# Altium schematic sheet TX.SchDoc
size A3; DocumentNumber: No here; SheetNumber: 1; SheetTotal: 1
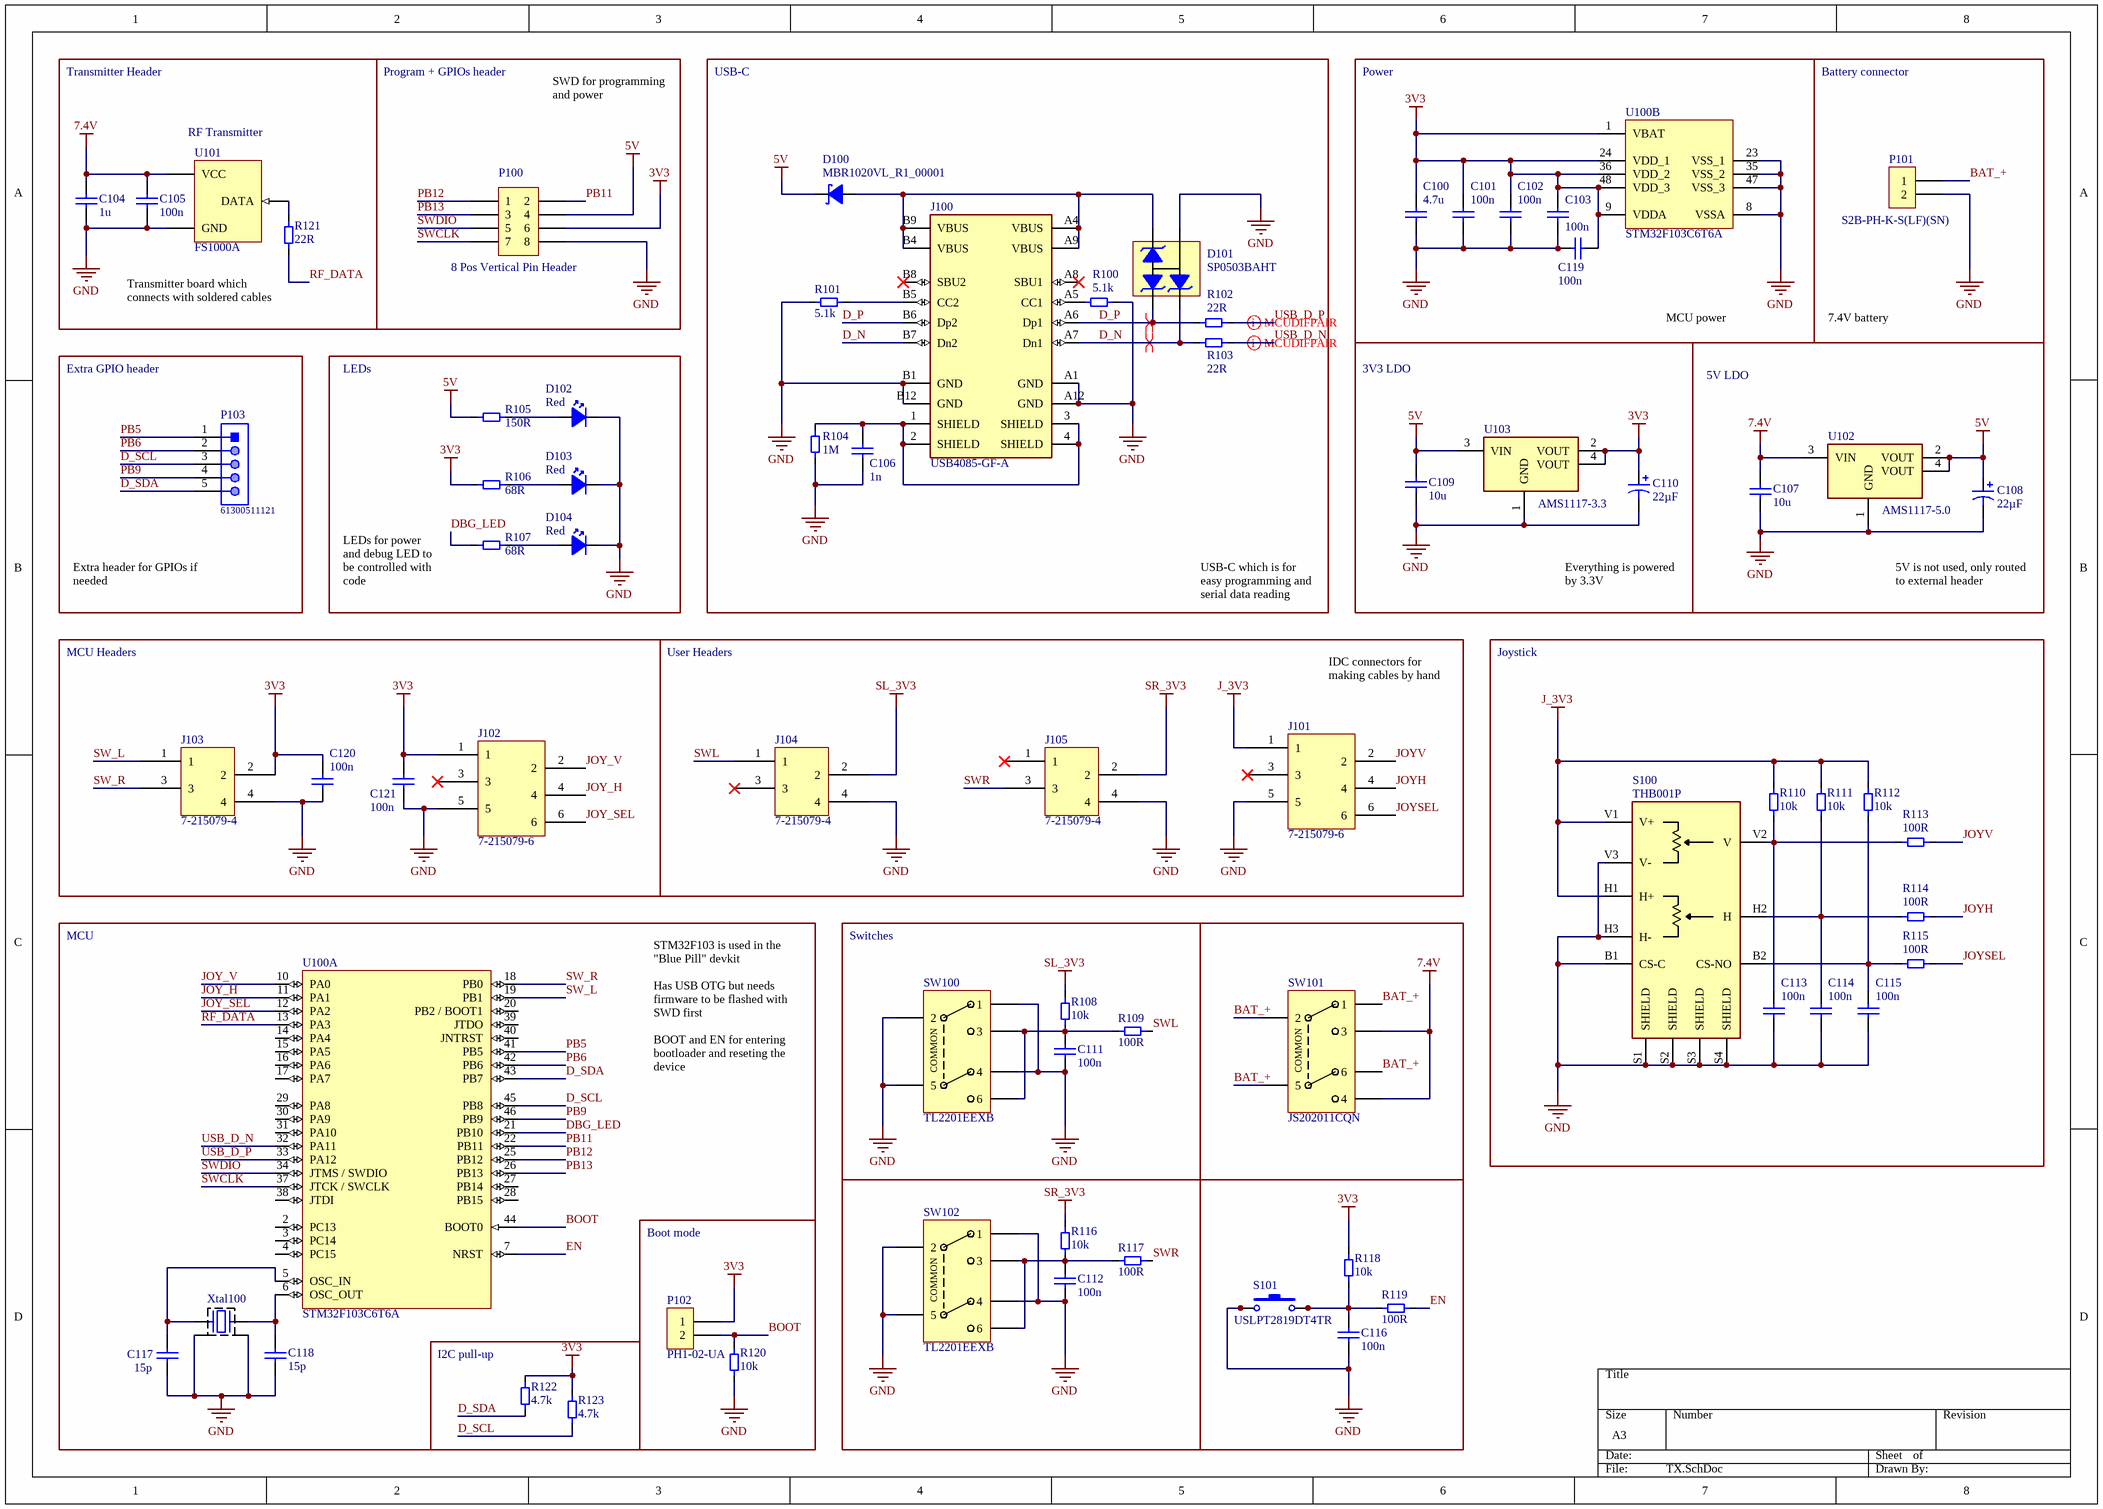
[diagram p0: TX.SchDoc]

## Parts
C100  4.7u  [MLCC_0805_M]
C101  100n  [MLCC_0603_M]
C102  100n  [MLCC_0603_M]
C103  100n  [MLCC_0603_M]
C104  1u  [MLCC_0603_M]
C105  100n  [MLCC_0603_M]
C106  1n  [MLCC_0603_M]
C107  10u  [MLCC_0805_M]
C108  value 22µF  [1210_Tantalum]  (hidden comment: TCJB226M025R0150)
C109  10u  [MLCC_0805_M]
C110  value 22µF  [1210_Tantalum]  (hidden comment: TCJB226M025R0150)
C111  100n  [MLCC_0603_M]
C112  100n  [MLCC_0603_M]
C113  100n  [MLCC_0603_M]
C114  100n  [MLCC_0603_M]
C115  100n  [MLCC_0603_M]
C116  100n  [MLCC_0603_M]
C117  15p  [MLCC_0402_M]
C118  15p  [MLCC_0402_M]
C119  100n  [MLCC_0603_M]
C120  100n  [MLCC_0603_M]
C121  100n  [MLCC_0603_M]
D100  MBR1020VL_R1_00001  [FP-MBR1020VL_R1_00001-MFG]
D101  SP0503BAHT  [LFUS-SOT143-4_V]
D102  Red  [0603 RED LED]
D103  Red  [0603 RED LED]
D104  Red  [0603 RED LED]
J100  USB4085-GF-A  [FP-USB4085-GF-A-MFG]
J101  7-215079-6  [7-215079-6-Footprint-1]
J102  7-215079-6  [7-215079-6-Footprint-1]
J103  7-215079-4  [7-215079-4]
J104  7-215079-4  [7-215079-4]
J105  7-215079-4  [7-215079-4]
P100  8 Pos Vertical Pin Header  [8 POS Vertical Pin Header]
P101  S2B-PH-K-S(LF)(SN)  [B5B-PH-K-S(LF)(SN)]
P102  PH1-02-UA  [2Pos Pin Header Vertical]
P103  61300511121  [61300511121]
R100  5.1k  [Resistor_0603_M]
R101  5.1k  [Resistor_0603_M]
R102  22R  [Resistor_0603_M]
R103  22R  [Resistor_0603_M]
R104  1M  [Resistor_1206_M]
R105  150R  [Resistor_0603_M]
R106  68R  [Resistor_0603_M]
R107  68R  [Resistor_0603_M]
R108  10k  [Resistor_0603_M]
R109  100R  [Resistor_0603_M]
R110  10k  [Resistor_0603_M]
R111  10k  [Resistor_0603_M]
R112  10k  [Resistor_0603_M]
R113  100R  [Resistor_0603_M]
R114  100R  [Resistor_0603_M]
R115  100R  [Resistor_0603_M]
R116  10k  [Resistor_0603_M]
R117  100R  [Resistor_0603_M]
R118  10k  [Resistor_0603_M]
R119  100R  [Resistor_0603_M]
R120  10k  [Resistor_0603_M]
R121  22R  [Resistor_0603_M]
R122  4.7k  [Resistor_0603_M]
R123  4.7k  [Resistor_0603_M]
S100  THB001P  [THB001P]
S101  USLPT2819DT4TR  [USLPT2819DT4TR-Footprint-1]
SW100  TL2201EEXB  [TL2201EEXB-Footprint-1]
SW101  JS202011CQN  [FP-JS202011CQN-MFG]
SW102  TL2201EEXB  [TL2201EEXB-Footprint-1]
U100  STM32F103C6T6A  [STM-LQFP48_M]  (parts A,B of 2)
U101  FS1000A  [2.54mm 3-pin horizontal]
U102  AMS1117-5.0  [SOT230P700X180-4N]
U103  AMS1117-3.3  [SOT-223 based on ZVP2110GTA]
Xtal100  ABM11-16.000MHZ-12-N1G-T  [FP-ABM11-MFG]  (value not drawn)

## Blocks framed on the sheet
Program + GPIOs header: P100
USB-C: C106 D100 D101 J100 R100-R104
Power: C100-C103 C119 U100
Battery connector: P101
3V3 LDO: C109 C110 U103
5V LDO: C107 C108 U102
Extra GPIO header: P103
LEDs: D102-D104 R105-R107
MCU Headers: C120 C121 J102 J103
User Headers: J101 J104 J105
Joystick: C113-C115 R110-R115 S100
MCU: C117 C118 U100 Xtal100
Switches: C111 R108 R109 SW100
Boot mode: P102 R120
I2C pull-up: R122 R123

## Nets
3V3: C100.2 C101.1 C102.1 C103.1 C110.1 C119.2 C120.2 C121.2 J102.1 J103.2 P100.6 P102.1 R106.1 R118.2 R122.2 R123.2 U100.1(VBAT) U100.9(VDDA) U100.24(VDD_1) U100.36(VDD_2) U100.48(VDD_3) U103.2(VOUT) U103.4(VOUT)
5V: C108.1 C109.2 D100.1(C) P100.4 R105.1 U102.2(VOUT) U102.4(VOUT) U103.3(VIN)
7.4V: C104.2 C105.2 C107.2 SW101.3 SW101.4 U101.2(VCC) U102.3(VIN)
GND: C100.1 C101.2 C102.2 C103.2 C104.1 C105.1 C106.1 C107.1 C108.2 C109.1 C110.2 C111.1 C112.1 C113.1 C114.1 C115.1 C116.1 C117.1 C118.1 C119.1 C120.1 C121.1 D101.1(A) D102.1(C) D103.1(C) D104.1(C) J100.A1(GND) J100.A12(GND) J100.B1(GND) J100.B12(GND) J101.5 J102.5 J103.4 J104.4 J105.4 P100.8 P101.2 R100.2 R101.1 R104.1 R120.1 S100.B1(CS-C) S100.H3(H-) S100.S1(SHIELD) S100.S2(SHIELD) S100.S3(SHIELD) S100.S4(SHIELD) S100.V3(V-) S101.1 S101.2 SW100.1 SW100.2 SW100.4 SW100.5 SW102.1 SW102.2 SW102.4 SW102.5 U100.8(VSSA) U100.23(VSS_1) U100.35(VSS_2) U100.47(VSS_3) U101.1(GND) U102.1(GND) U103.1(GND) Xtal100.2 Xtal100.4
J_3V3: J101.1 R110.2 R111.2 R112.2 S100.H1(H+) S100.V1(V+)
SL_3V3: J104.2 R108.2
SR_3V3: J105.2 R116.2
BAT_+: P101.1 SW101.1 SW101.2 SW101.5 SW101.6
BOOT: P102.2 R120.2 U100.44(BOOT0)
D_N: D101.4(C) J100.A7(Dn1) J100.B7(Dn2) R103.1
D_P: D101.3(C) J100.A6(Dp1) J100.B6(Dp2) R102.1
D_SCL: P103.3 R123.1 U100.45(PB8)
D_SDA: P103.5 R122.1 U100.43(PB7)
DBG_LED: R107.1 U100.21(PB10)
EN: R119.2 U100.7(NRST)
JOY_H: J102.4 U100.11(PA1)
JOY_SEL: J102.6 U100.12(PA2)
JOY_V: J102.2 U100.10(PA0)
JOYH: J101.4 R114.2
JOYSEL: J101.6 R115.2
JOYV: J101.2 R113.2
PB5: P103.1 U100.41(PB5)
PB6: P103.2 U100.42(PB6)
PB9: P103.4 U100.46(PB9)
PB11: P100.2 U100.22(PB11)
PB12: P100.1 U100.25(PB12)
PB13: P100.3 U100.26(PB13)
RF_DATA: R121.2 U100.13(PA3)
SW_L: J103.1 U100.19(PB1)
SW_R: J103.3 U100.18(PB0)
SWCLK: P100.7 U100.37(JTCK_/_SWCLK)
SWDIO: P100.5 U100.34(JTMS_/_SWDIO)
SWL: J104.1 R109.2
SWR: J105.3 R117.2
USB_D_N: R103.2 U100.32(PA11)
USB_D_P: R102.2 U100.33(PA12)
NetC106_2: C106.2 J100.1(SHIELD) J100.2(SHIELD) J100.3(SHIELD) J100.4(SHIELD) R104.2
NetC111_2: C111.2 R108.1 R109.1 SW100.3 SW100.6
NetC112_2: C112.2 R116.1 R117.1 SW102.3 SW102.6
NetC113_2: C113.2 R110.1 R113.1 S100.V2(V)
NetC114_2: C114.2 R111.1 R114.1 S100.H2(H)
NetC115_2: C115.2 R112.1 R115.1 S100.B2(CS-NO)
NetC116_2: C116.2 R118.1 R119.1 S101.3 S101.4
NetC117_2: C117.2 U100.5(OSC_IN) Xtal100.1
NetC118_2: C118.2 U100.6(OSC_OUT) Xtal100.3
NetD100_2: D100.2(A) D101.2(C) J100.A4(VBUS) J100.A9(VBUS) J100.B4(VBUS) J100.B9(VBUS)
NetD102_2: D102.2(A) R105.2
NetD103_2: D103.2(A) R106.2
NetD104_2: D104.2(A) R107.2
NetJ100_A5: J100.A5(CC1) R100.1
NetJ100_B5: J100.B5(CC2) R101.2
NetR121_1: R121.1 U101.3(DATA)

Not connected (* = marked no-connect by the designer): J100 A8(SBU1)* B8(SBU2)*; J101 3*; J102 3*; J104 3*; J105 1*; U100 2(PC13) 3(PC14) 4(PC15) 14(PA4) 15(PA5) 16(PA6) 17(PA7) 20(PB2_/_BOOT1) 27(PB14) 28(PB15) 29(PA8) 30(PA9) 31(PA10) 38(JTDI) 39(JTDO) 40(JNTRST)

## Layout directives
differential pair: D_N, D_P, USB_D_N, USB_D_P

## Notes on the sheet
- Transmitter Header
- SWD for programming and power
- (near U101) RF Transmitter
- Transmitter board which connects with soldered cables
- MCU power
- 7.4V battery
- Extra header for GPIOs if needed
- LEDs for power and debug LED to be controlled with code
- USB-C which is for easy programming and serial data reading
- Everything is powered by 3.3V
- 5V is not used, only routed to external header
- (near J101) IDC connectors for making cables by hand
- STM32F103 is used in the "Blue Pill" devkit
  Has USB OTG but needs firmware to be flashed with SWD first
  BOOT and EN for entering bootloader and reseting the device
- Title:
- Revision:
- Date:
- Size:
- A3
- Sheet:
- of
- Variant:
- Project:
- Revision R&D:
- Last modified:
- Checked By:
- This document and its contents are the property of =GlobalCompanyName . Any unauthorized reproduction, distribution, or disclosure to third parties of this document or its contents, in whole or in part, without prior written agreement from =GlobalCompanyName is strictly prohibited and may be subject to legal action.
- (in symbol CMP-ROOT-01258-1) COMMON
- (in symbol CMP-ROOT-01260-4) COMMON

## Library data of the parts
C100 = CMP-001-1830-1: MLCC, 0805, 4.7u, 20%, 50V, X5R; Manufacturer: Any; Capacitor Type: Ceramic; Value: 4.7µF; Mount: SMD; Case/Package: 0805; Dielectric: X5R; RoHS: Yes; Part number: MLCC, 0805, 4.7u, 20%, 50V, X5R; Voltage: 50V; Tolerance: 20%
C101-C103 C105 C111-C116 C119-C121 = CMP-001-0815-1: MLCC, 0603, 100n, 10%, 50V, X7R; Manufacturer: Any; Value: 100nF; Capacitor Type: Ceramic; Part number: MLCC, 0603, 100n, 10%, 50V, X7R; RoHS: Yes; Dielectric: X7R; Mount: SMD; Voltage: 50V; Tolerance: 10%; Case/Package: 0603
C104 = CMP-001-0565-1: MLCC, 0603, 1u, 10%, 50V, X5R; Manufacturer: Any; Capacitor Type: Ceramic; Value: 1µF; Part number: MLCC, 0603, 1u, 10%, 50V, X5R; Dielectric: X5R; Voltage: 50V; RoHS: Yes; Tolerance: 10%; Mount: SMD; Case/Package: 0603
C106 = CMP-001-0786-1: MLCC, 0603, 1n, 10%, 50V, X7R; Manufacturer: Any; Value: 1nF; Capacitor Type: Ceramic; RoHS: Yes; Mount: SMD; Dielectric: X7R; Case/Package: 0603; Part number: MLCC, 0603, 1n, 10%, 50V, X7R; Voltage: 50V; Tolerance: 10%
C107 C109 = CMP-001-0829-2: MLCC, 0805, 10u, 10%, 50V, X5R; Manufacturer: Any; Value: 10µF; Capacitor Type: Ceramic; RoHS: Yes; Tolerance: 10%; Voltage: 50V; Mount: SMD; Case/Package: 0805; Part number: MLCC, 0805, 10u, 10%, 50V, X5R; Dielectric: X5R
C108 C110 = CMP-0001-00036-4: Cap Tant Solid 22uF 25V B CASE 20% (3.5 X 2.8 X 1.9mm) SMD 3528-21 0.15 Ohm 105°C T/R; Manufacturer: AVX Corporation; Life (Hours): 2000Hour; Capacitor Type: Molded; Dielectric: X5R; ESR (Equivalent Series Resistance): 150mR; Tolerance: 20%; Capacitance: 22uF; Features: General Purpose; Mount: Surface Mount; Package Quantity: 2000; Radiation Hardening: No; Termination: SMD/SMT; Length: 0.138inch; Height: 1.9mm; Height - Seated (Max): 0.083inch; Depth: 2.8mm; Voltage Rating: 25V; Part number: TCJB226M025R0150; Case Code (Imperial): 1210; Width: 0.11inch; Packaging: Tape and Reel; Max Operating Temperature: 105°C; Voltage Rating (DC): 25V; Min Operating Temperature: -55°C; Case Code (Metric): 3528; REACH SVHC: No SVHC; RoHS: Yes; Case/Package: 1210
C117 C118 = CMP-001-1853-1: MLCC, 0402, 15p, 10%, 25V, C0G/NP0; Manufacturer: Any; Capacitor Type: Ceramic; Voltage Rating: 25; Value: 15pF; Dielectric: C0G; Temperature Coefficient: 300ppm/°C; Height: 0.5mm; Width: 0.02inch; Contact Plating: Tin; Package Quantity: 1; Case/Package: 0402; Depth: 0.5mm; Material: Ceramic; Packaging: Tape and Reel; Radiation Hardening: No; Case Code (Imperial): 0402; Min Operating Temperature: -55°C; Mount: Surface Mount; RoHS: Yes; Length: 1mm; Thickness: 0.022inch; Part number: MLCC, 0402, 15p, 10%, 25V, C0G/NP0; Capacitance: 15pF; Tolerance: 10%; Case Code (Metric): 1005; Voltage: 25V; Max Operating Temperature: 125°C
D100 = CMP-ROOT-01310-1: Rectifier Diode, Schottky, 1 Phase, 1 Element, 1A, 20V V(RRM), Silicon; Manufacturer: Panjit; Max Forward Surge Current (Ifsm): 45A; Max Junction Temperature (Tj): 125°C; Number of Elements: 1; Peak Reverse Current: 600µA; Case/Package: SOD-123FL; Mount: SMD; Part number: MBR1020VL_R1_00001; Pins: 2; RoHS: Compliant; Forward Current: 1A; Height: 1.1mm; Lifecycle Status: Production; Max Operating Temperature: 125°C; Max Output current: 1A; Max Repetitive Reverse Voltage (Vrrm): 20V; Min Operating Temperature: -55°C; Number of Terminals: 2; REACH SVHC: No; Reverse Standoff Voltage: 20V
D101 = CMP-ROOT-01259-1: SP050xBA Series 8.5 V 30 pF Triple Uni-Directional TVS Avalanche Diode-SOT143-4; Manufacturer: Littelfuse Inc.; Breakdown Voltage: 5.5V; Value: 30pF; Clamping Voltage: 6.8V; Direction: Unidirectional; ESD Protection: Yes; Element Configuration: Common Anode; Leakage Current: 100nA; Max Power Dissipation: 225mW; Number of Channels: 3; Power Line Protection: No; Voltage Rating (DC): 5V; Case/Package: SOT-143; Mount: SMD; Part number: SP0503BAHT; Pins: 4; RoHS: Compliant; China RoHS: Compliant; Composition: Zener; Depth: 1.4mm; Diode Type: Avalanche; Height: 1.22mm; Lead Free: Lead Free; Length: 3.04mm; Lifecycle Status: Production; Max Operating Temperature: 125°C; Max Reverse Leakage Current: 100nA; Min Operating Temperature: -40°C; Mounting Technology: Surface Mount; Number of Elements: 3; Number of Terminals: 4; Number of Unidirectional Channels: 3; Operating Supply Voltage: 5.5V; Peak Pulse Power: 225mW; Polarity: Unidirectional; Power Dissipation: 225mW; REACH SVHC: Yes; Radiation Hardening: No; Reverse Standoff Voltage: 5.5V; Schedule B: 8536300000, 8536300000; Termination: SMD/SMT; Width: 1.4mm; Working Voltage: 5.5V
D102-D104 = CMP-ROOT-00025-2: Generic red 0603 LED; Part number: Any Red 0603 LED; Manufacturer: Any; Color: Red; Case/Package: 0603; Mount: SMD; RoHS: Yes
J100 = CMP-001-1800-1: USB Connector, 16 Contact(s), Female, Right Angle, Solder Terminal, Locking, Receptacle; Manufacturer: GCT; Part number: USB4800-03-A; USB Standard: USB 2.0; Standoff Height: 3.5mm; USB PD: 3.2; Current Rating: 4.25A; Mating Cycles: 10000; Number of Contacts: 16; Number of Ports: 1; Shielding: Shielded; Voltage Rating: 20V; RoHS: Yes; Pins: 16; Mount: TH; Connector Type: USB; Contact Material: Copper Alloy; Contact Plating: Gold; Flammability Rating: UL94 V-0; Gender: Receptacle; Height: 3.66mm; Insulation Color: Black; Max Operating Temperature: 85°C; Min Operating Temperature: -40°C; Mounting Technology: Through Hole,Horizontal; Number of Positions: 16; Orientation: Right Angle; Packaging: Tape and Reel; Series: USB4085; Termination: Solder
J101 J102 = CMP-ROOT-01311-2: Conn FFC Connector F 6 POS 1.27mm Solder ST Thru-Hole Automotive Box/Carton; Manufacturer: TE Connectivity; Manufacturer Lifecycle Status: ACTIVE; Contact Current Rating: 1A; Contact Resistance: 10mΩ; Insulation Resistance: 1GΩ; Mating Connector Lock: Without; Number of Contacts: 6; Number of Ports: 1; Operating Force: 4.8928N; Operating Supply Voltage: 100V; PCB Mount Retention: With; Plating Thickness: 4.99999µm; Row Spacing: 2.54mm; Shielding: No; Mount: TH; Part number: 7-215079-6; Pins: 6; RoHS: Compliant; China RoHS: Compliant; Color: Red; Contact Gender: Female; Contact Material: Nickel, Tin; Contact Plating: Tin; Current Rating: 1A; Height: 4.2mm; Housing Color: Red; Insulation Material: Thermoplastic; Lead Free: Lead Free; Lead Pitch: 1.27mm; Length: 9.7mm; Lifecycle Status: Production; Max Operating Temperature: 105°C; Min Operating Temperature: -40°C; Mounting Technology: Through Hole; Number of Positions: 6; Number of Rows: 2; Orientation: Vertical; Packaging: Box; REACH SVHC: Yes; Terminal Pitch: 1.27mm; Voltage Rating: 100V; Voltage Rating (DC): 100V
J103-J105 = CMP-ROOT-01314-1: Conn FFC Connector F 4 POS 1.27mm Solder ST Thru-Hole Box/Carton; Manufacturer: TE connectivity; Part number: 7-215079-6; Manufacturer Lifecycle Status: ACTIVE; Contact Current Rating: 1A; Contact Resistance: 10mΩ; Gender: Female; Insulation Resistance: 1GΩ; Mating Connector Lock: Without; Number of Contacts: 4; Number of Ports: 1; Operating Force: 4.8928N; Operating Supply Voltage: 100V; PCB Mount Retention: With; Plating Thickness: 4.99999µm; Row Spacing: 2.54mm; Shielding: No; Mount: TH; Pins: 4; RoHS: Compliant; China RoHS: Compliant; Color: Red; Contact Gender: Female; Contact Material: Nickel, Tin; Contact Plating: Tin; Current Rating: 1A; Height: 4.2mm; Housing Color: Red; Insulation Material: Thermoplastic; Lead Pitch: 1.27mm; Length: 7.0866mm; Lifecycle Status: Production; Max Operating Temperature: 105°C; Min Operating Temperature: -40°C; Mounting Technology: Through Hole; Number of Positions: 4; Number of Rows: 2; Orientation: Vertical; Packaging: Box; REACH SVHC: Yes; Terminal Pitch: 1.27mm; Voltage Rating: 100V; Voltage Rating (DC): 100V
P100 = CMP-ROOT-00235-2: Connector Header Through Hole 8 position 0.100" (2.54mm); Manufacturer: Amphenol ICC (FCI); Part number: 67997-208HLF; Number of Contacts: 8; Gender: Male; Max Voltage Rating (AC): 1.5kV; Contact Post Length: 3.05mm; Insulation Resistance: 5GR; Connector Type: Male Pin; Row Spacing: 0.1inch; Current Rating: 3A; Pins: 8; RoHS: Yes; Orientation: Straight; Mount: Through Hole; Min Operating Temperature: -65°C; Contact Gender: Male; Contact Material: Bronze; Number of Rows: 2; Max Operating Temperature: 125°C; Radiation Hardening: No; Housing Color: Black; Packaging: Bulk; Contact Mating Length: 0.23inch; Pitch: 2.54mm; Voltage Rating: 1.5kV; Color: Black; REACH SVHC: No SVHC; Number of Positions: 8; Package Quantity: 100; Length: 10.16mm; Contact Plating: Gold,GXT; Termination: Solder; Depth: 4.83mm; Housing Material: Thermoplastic
P101 = CMP-ROOT-00728-2: Conn Shrouded Header (4 Sides) HDR 2 POS 2mm Solder RA Thru-Hole Box; Manufacturer: JST Sales America Inc.; Number of Contacts: 2; Voltage Rating: 100V; Contact Resistance: 20mR; Current Rating: 2A; Insulation Resistance: 1GR; Gender: Male; Connector Type: Male Pin; Min Operating Temperature: -25°C; Part number: S2B-PH-K-S(LF)(SN); Packaging: Bulk; REACH SVHC: No SVHC; Number of Pins: 2; Lead Pitch: 2mm; Height: 9.4mm; Contact Mating Length: 0.13inch; Series: PH; Pitch: 2mm; Fastening Type: Detent; Voltage Rating (AC): 100V; Contact Material: Tin,Brass,Bronze; Max Voltage Rating (AC): 100V; Number of Rows: 1; Flammability Rating: UL94 V-0; Housing Color: White; Depth: 7.6mm; Contact Type: Male Pin; Width: 4.5mm; Working Voltage: 100V; Max Voltage Rating (DC): 100V; Max Operating Temperature: 85°C; RoHS: Yes; Termination: Solder; Contact Plating: Tin,Copper; Lead Free: Lead Free; Number of Poles: 2; Length: 5.9mm; Housing Material: Polyamide; Number of Positions: 2; Mount: Through Hole; Orientation: Right Angle; Max Current Rating: 2A; Color: Natural,White
P102 = CMP-002-000007-1: Conn Unshrouded Header HDR 2 POS 2.54mm Solder ST Top Entry Thru-Hole Bag; Part number: PH1-04-UA; Manufacturer: Adam Tech; Number of Positions: 2; Contact Resistance: 20mΩ; Current Rating: 3A; Insulation Resistance: 5GΩ; Voltage Rating: 250V; Pins: 2; RoHS: Compliant; Mount: TH; Lead Free: Lead Free; Pitch: 2.54mm; Termination: Solder; Contact Gender: Male; Contact Material: Brass; Contact Plating: Gold; Height: 9.2456mm; Housing Material: PBT; Lifecycle Status: Production; Number of Contacts: 2; Number of Rows: 1; REACH SVHC: Yes; Schedule B: 8536694040, 8536694040; Terminal Pitch: 2.54mm
P103 = CMP-ROOT-01020-1: Conn Unshrouded Header HDR 5 POS 2.54mm Solder ST Top Entry Thru-Hole Bag; Manufacturer: Wurth; Mount: TH; Part number: 61300511121; RoHS: Yes
R100 R101 = CMP-001-0094-2: Resistor, 0603, 5.1k, 1%, 1/10W; Manufacturer: Any; Power: 100mW; Value: 5,1k; Case/Package: 0603; Part number: Resistor, 0603, 5.1k, 1%, 1/10W; Mount: SMD; Tolerance: 1%; RoHS: Yes
R102 R103 R121 = CMP-001-0038-3: Resistor, 0603, 22R, 1%, 1/10W; Manufacturer: Any; Value: 22; Power: 100mW; Part number: Resistor, 0603, 22R, 1%, 1/10W; Tolerance: 1%; Case/Package: 0603; Mount: SMD; RoHS: Yes
R104 = CMP-0001-00051-1: Resistor, 1206, 1M, 1%, 1/4W; Manufacturer: Any; Case/Package: 1206; RoHS: Yes; Value: 1M; Mount: SMD; Part number: Any
R105-R107 = CMP-001-0060-2: Resistor, 0603, 200R, 1%, 1/10W; Manufacturer: Any; Value: 200; Power: 100mW; RoHS: Yes; Part number: Resistor, 0603, 200R, 1%, 1/10W; Mount: SMD; Tolerance: 1%; Case/Package: 0603
R108 R110-R112 R116 R118 = CMP-001-0101-2: Resistor, 0603, 10k, 1%, 1/10W; Manufacturer: Any; Power: 100mW; Tolerance: 1%; Value: 10k; RoHS: Yes; Mount: SMD; Case/Package: 0603; Part number: Resistor, 0603, 10k, 1%, 1/10W
R109 R113-R115 R117 R119 = CMP-001-0054-5: Resistor, 0603, 100R, 1%, 1/10W; Manufacturer: Any; Value: 100; Power: 100mW; Case/Package: 0603; Mount: SMD; Part number: Resistor, 0603, 100R, 1%, 1/10W; Tolerance: 1%; RoHS: Yes
R120 = CMP-0001-00257-1: Resistor, 0603, 10k, ≤5%, ≥1/16W; Manufacturer: Any; Case/Package: 0603; Mount: SMD; Part number: Resistor, 0603, 10k, ≤5%, ≥1/16W; RoHS: Yes; Value: 10k
R122 R123 = CMP-001-0093-2: Resistor, 0603, 4.7k, 1%, 1/10W; Manufacturer: Any; Power: 100mW; Value: 4,7k; Part number: Resistor, 0603, 4.7k, 1%, 1/10W; Case/Package: 0603; RoHS: Yes; Tolerance: 1%; Mount: SMD
S100 = CMPL-001-A00000-7: Multi-Directional Thumbstick, 2 Axis, Center Momentary Switch, 12VDC, THB Series; pin to pad: B1>B1A+B1B B2>B2A+B2B; Manufacturer: Littelfuse; Value: 10kR; Actuator Type: Joystick; Operating Force: 715gf; Voltage Rating (DC): 12V; Package: None; Price: None; Mount: TH; Part number: THB001P; Pins: 12; RoHS: Yes; Max Operating Temperature: 70°C; Min Operating Temperature: -10°C; Mounting Technology: Through Hole; Termination: PC Pin
S101 = CMP-ROOT-01290-1: Keypad Switch, SPST, 0.05A, 1.96N, Solder Terminal, Panel Mount; Manufacturer: TE Connectivity ALCOSWITCH Switches; Contact Current Rating: 50mA; Case/Package: Non-standard; Mount: SMD; Part number: USLPT2819DT4TR; RoHS: Compliant; China RoHS: Compliant; Color: Black; Contact Material: Stainless Steel; Contact Plating: Silver; Housing Material: Polyethylene; Lifecycle Status: Production; Max Current Rating: 50mA; Max Operating Temperature: 85°C; Min Operating Temperature: -40°C; Operating Force: 1.96N; Packaging: Tape & Reel; REACH SVHC: Yes; Throw Configuration: SPST
SW100 SW102 = CMP-ROOT-01258-1: Pushbutton Switch, DPDT, ON-ON, 100 mA, 30V DC, PC Pin, TL2201 Series; Manufacturer: E-Switch; Actuator Length: 5.5118mm; Actuator Material: Acetal; Contact Resistance: 100mΩ; Current Rating: 100mA; Electrical Life: 10kcycles; Number of Positions: 2; Case/Package: Non-standard; Mount: TH; Part number: TL2201EEXB; Pins: 6; RoHS: Compliant; Contact Plating: Silver; Height: 8.509mm; Insulation Resistance: 100MΩ; Length: 8.509mm; Lifecycle Status: Production; Max Current Rating: 100mA; Max Voltage Rating (DC): 30V; Mounting Technology: Through Hole; REACH SVHC: Yes; Switch Function: On-On; Termination: PC Pin; Throw Configuration: DPDT; Voltage Rating (DC): 30V
SW101 = CMP-ROOT-01260-4: Slide Switch, 1 Positions, Dpdt, Latched, 0.3A, 6Vdc, 6 Pcb Hole Cnt, Solder Terminal, Through; Manufacturer: C&K; Actuator Length: 2.0066mm; Actuator Material: Nylon; Contact Current Rating: 300mA; Contact Resistance: 70mΩ; Electrical Life: 5kcycles; Illumination Type: Non-Illuminated; Insulation Resistance: 100MΩ; Max Voltage Rating (DC): 6V; Number of Positions: 1; Switch Function: On-On; Switch Travel: 2mm; Case/Package: Non-standard; Mount: SMD; Part number: JS202011CQN; Pins: 6; RoHS: Compliant; Color: Black; Contact Plating: Silver; Current Rating: 300mA; Depth: 3.6mm; Flammability Rating: UL94 V-0; Height: 3.5mm; Housing Material: Nylon; Lead Free: Lead Free; Length: 9mm; Life (Cycles): 5kcycles; Lifecycle Status: Production; Max Current Rating: 300mA; Max Operating Temperature: 85°C; Min Operating Temperature: -40°C; Mounting Technology: Through Hole; Orientation: Vertical; Packaging: Bulk; REACH SVHC: Yes; Radiation Hardening: No; Terminal Material: Brass; Termination: PC Pins; Throw Configuration: DPDT; Voltage Rating (DC): 6V
U100 = CMP-00012-1: MCU 32-bit STM32F ARM Cortex M3 RISC 32KB Flash 2.5V/3.3V 48-Pin LQFP Tray; Manufacturer: STMicroelectronics; Part number: STM32F103C8T6; Address Bus Width: 32b; Frequency: 72MHz; Interface: CAN, I2C, IrDA, LIN, SPI, UART, USART, USB; Clock Frequency: 16MHz; Max Power Dissipation: 363mW; Max Supply Current: 45mA; Max Supply Voltage: 3.6V; Min Supply Voltage: 2V; Nominal Supply Current: 1.55µA; Number of A/D Converters: 2; Number of ADC Channels: 10; Number of I/Os: 37; Number of I2C Channels: 1; Number of Timers/Counters: 3; Operating Supply Voltage: 3.3V; Oscillator Type: Internal; Peripherals: DMA, I2C, POR, PWM, Temp Sensor, WDT; RAM Size: 10kB; Watchdog Timer: Yes; Case/Package: LQFP; China RoHS: Compliant; Core Architecture: ARM; Data Bus Width: 32b; Flash Memory Size: 32kB; Height: 1.45mm; Lead Free: Lead Free; Length: 7mm; Lifecycle Status: Production; Max Operating Temperature: 85°C; Memory Size: 32kB; Memory Format: FLASH; Min Operating Temperature: -40°C; Number of Channels: 10; Pins: 48; Number of Programmable I/O: 37; Number of SPI Channels: 1; Number of Terminals: 48; Number of USART Channels: 2; REACH SVHC: Yes; Radiation Hardening: No; RoHS: Compliant; Schedule B: 8542310000; Terminal Pitch: 500µm; Width: 7mm; Mount: SMD
U101 = CMP-ROOT-01261-3: FS1000A 433MHZ RF transmitter & XY-MK-5V Receiver Module; Case/Package: Non-standard; Manufacturer: -; Mount: SMD; Part number: FS1000A; Pins: 3; RoHS: Yes
U102 = CMP-00014-1: LDO Regulator Pos 5V 1A 4-Pin(3+Tab) SOT-223 / 1A LOW DROPOUT VOLTAGE REGULATOR; Manufacturer: EVVO; Output type: Fixed; Voltage Input (Max): 12V; Voltage Dropout (Max): 1.3V @ 1A; REACH SVHC: Yes; RoHS: Compliant; Case/Package: SOT-223; Mount: SMD; Part number: AMS1117-5.0; Voltage Output (Mix/Fixed): 5V; Current Output: 1A
U103 = CMP-00009-1: Gull Wing EAR99 Fixed Positive Single Output Ldo Regulator Dual Voltage Regulator Linear 125C 1.2W 1A 1.8MM; Manufacturer: Shenzhen Slkormicro Semicon Co., Ltd.; Dropout Voltage: 1.1V; Max Supply Voltage: 15V; Max Junction Temperature (Tj): 125°C; Nominal Supply Current: 5mA; Number of Outputs: 1; Output Voltage: 3.3V; Mount: SMD; Part number: AMS1117-3.3; Case/Package: SOT-223; Height: 1.8mm; Max Operating Temperature: 125°C; Max Power Dissipation: 1.2W; Min Operating Temperature: -40°C; Pins: 2; Output Current: 1A; RoHS: Compliant
Xtal100 = CMP-ROOT-01254-3: Crystal 16MHz ±10ppm (Tol) ±15ppm (Stability) 12pF FUND 150Ohm 4-Pin Ultra Mini-CSMD T/R; Manufacturer: Abracon LLC; ESR (Equivalent Series Resistance): 150Ω; Frequency Tolerance: 0.001%; Case/Package: 4-SMD, No Lead; Mount: SMD; RoHS: Compliant; China RoHS: Compliant; Frequency: 16MHz; Frequency Stability: 15ppm; Height: 590µm; Length: 2mm; Lifecycle Status: Production; Load Capacitance: 12pF; Max Operating Temperature: 85°C; Min Operating Temperature: -30°C; Mounting Technology: Surface Mount; REACH SVHC: Yes; Schedule B: 8541600080; ESR: 150Ω; Tolerance: 0.001%; Width: 1.6mm